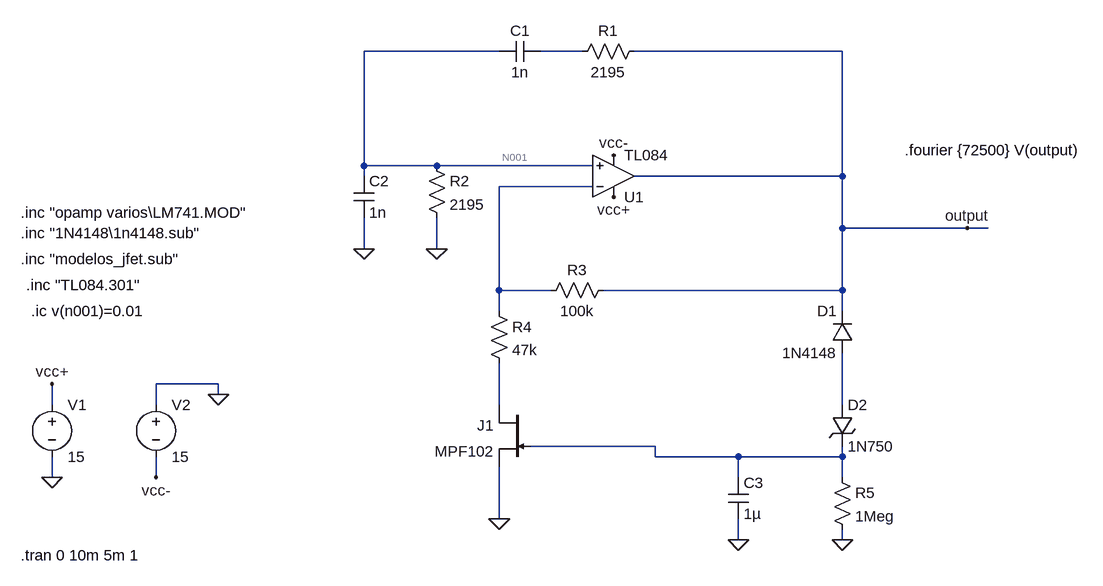
[diagram p0: schematic wien.asc]
wien.asc, the LTspice schematic file:
Version 4
SHEET 1 1104 1108
WIRE 80 112 -128 112
WIRE 208 112 144 112
WIRE 608 112 288 112
WIRE -128 288 -128 112
WIRE -16 288 -128 288
WIRE 224 288 -16 288
WIRE -128 304 -128 288
WIRE 608 304 608 112
WIRE 608 304 288 304
WIRE 224 320 80 320
WIRE 608 384 608 304
WIRE 800 384 608 384
WIRE 832 384 800 384
WIRE -128 416 -128 368
WIRE -16 416 -16 368
WIRE 80 480 80 320
WIRE 160 480 80 480
WIRE 608 480 608 384
WIRE 608 480 240 480
WIRE 80 512 80 480
WIRE 608 512 608 480
WIRE -352 624 -448 624
WIRE -352 640 -352 624
WIRE -608 656 -608 624
WIRE -448 656 -448 624
WIRE 80 656 80 592
WIRE 608 656 608 576
WIRE 320 720 128 720
WIRE 320 736 320 720
WIRE 448 736 320 736
WIRE 608 736 608 720
WIRE 608 736 448 736
WIRE -608 768 -608 736
WIRE -448 768 -448 736
WIRE 448 768 448 736
WIRE 608 768 608 736
WIRE 80 832 80 752
WIRE 448 864 448 832
WIRE 608 864 608 848
FLAG 448 864 0
FLAG 608 864 0
FLAG -608 768 0
FLAG -352 640 0
FLAG -608 624 vcc+
FLAG -448 768 vcc-
FLAG 80 832 0
FLAG -128 416 0
FLAG -16 416 0
FLAG 256 336 vcc+
FLAG 256 272 vcc-
FLAG 800 384 output
SYMBOL res 304 96 R90
WINDOW 0 0 56 VBottom 2
WINDOW 3 32 56 VTop 2
SYMATTR InstName R1
SYMATTR Value 2195
SYMBOL cap 144 96 R90
WINDOW 0 0 32 VBottom 2
WINDOW 3 32 32 VTop 2
SYMATTR InstName C1
SYMATTR Value 1n
SYMATTR SpiceLine V=0
SYMBOL cap -144 304 R0
SYMATTR InstName C2
SYMATTR Value 1n
SYMBOL res -32 272 R0
SYMATTR InstName R2
SYMATTR Value 2195
SYMBOL res 256 464 R90
WINDOW 0 0 56 VBottom 2
WINDOW 3 32 56 VTop 2
SYMATTR InstName R3
SYMATTR Value 100k
SYMBOL diode 624 576 R180
WINDOW 0 24 64 Left 2
WINDOW 3 24 0 Left 2
SYMATTR InstName D1
SYMATTR Value 1N4148
SYMBOL zener 592 656 R0
SYMATTR InstName D2
SYMATTR Value 1N750
SYMBOL res 592 752 R0
SYMATTR InstName R5
SYMATTR Value 1Meg
SYMBOL cap 432 768 R0
SYMATTR InstName C3
SYMATTR Value 1µ
SYMBOL voltage -608 640 R0
WINDOW 123 0 0 Left 2
WINDOW 39 0 0 Left 2
SYMATTR InstName V1
SYMATTR Value 15
SYMBOL voltage -448 640 R0
WINDOW 123 0 0 Left 2
WINDOW 39 0 0 Left 2
SYMATTR InstName V2
SYMATTR Value 15
SYMBOL res 64 496 R0
SYMATTR InstName R4
SYMATTR Value 47k
SYMBOL njf 128 656 M0
SYMATTR InstName J1
SYMATTR Value MPF102
SYMBOL Opamps\\opamp2 256 368 M180
SYMATTR InstName U1
SYMATTR Value TL084
TEXT -656 360 Left 2 !.inc "opamp varios\\LM741.MOD"
TEXT -656 392 Left 2 !.inc "1N4148\\1n4148.sub"
TEXT -656 432 Left 2 !.inc "modelos_jfet.sub"
TEXT -656 888 Left 2 !.tran 0 10m 5m 1
TEXT -648 472 Left 2 !.inc "TL084.301"
TEXT -640 512 Left 2 !.ic v(n001)=0.01
TEXT 704 264 Left 2 !.fourier {72500} V(output)

The netlist it stands for:
* wien.asc
R1 output N002 2195
C1 N002 N001 1n V=0
C2 N001 0 1n
R2 N001 0 2195
R3 output N003 100k
D1 N005 output 1N4148
D2 N005 N006 1N750
R5 N006 0 1Meg
C3 N006 0 1µ
V1 vcc+ 0 15
V2 0 vcc- 15
R4 N003 N004 47k
J1 N004 N006 0 MPF102
XU1 N001 N003 vcc+ vcc- output TL084  ; pins In+ In- V+ V- OUT
.model D D
.lib standard.dio
.model NJF NJF
.model PJF PJF
.lib standard.jft
.inc "opamp varios\LM741.MOD"
.inc "1N4148\1n4148.sub"
.inc "modelos_jfet.sub"
.tran 0 10m 5m 1
.inc "TL084.301"
.ic v(n001)=0.01
.fourier {72500} V(output)
.backanno
.end